# EAGLE schematic HID (EAGLE 8.0.1)
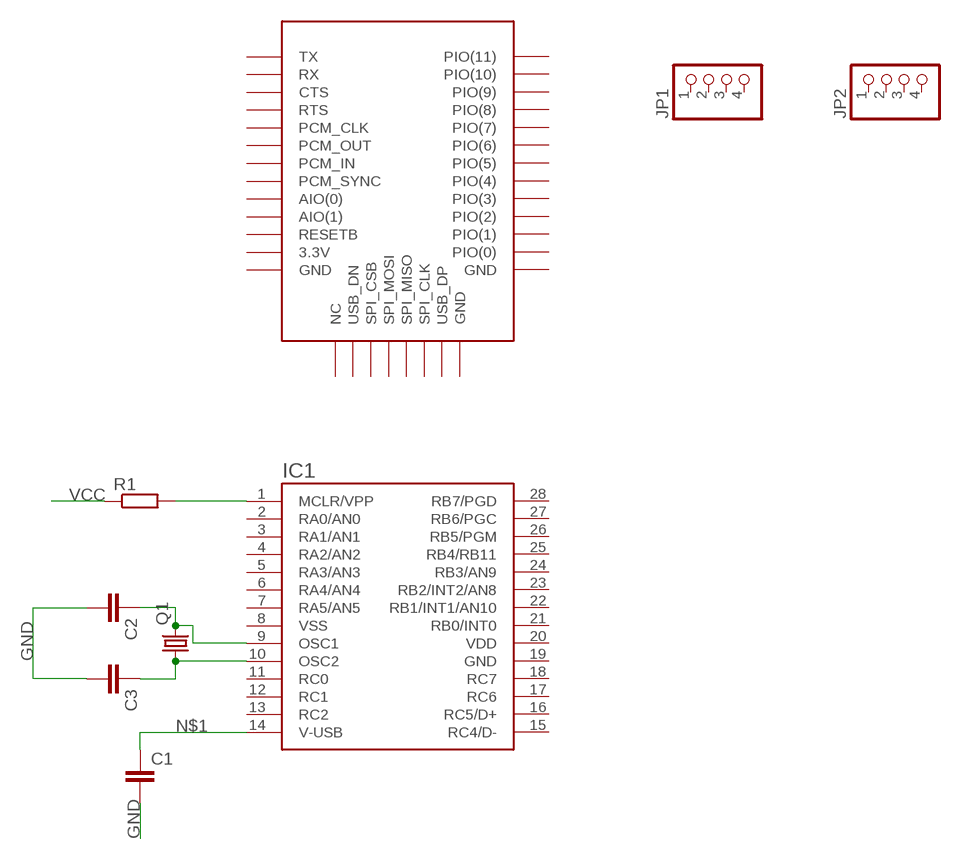
[diagram p0: schematic, sheet 1]

## Parts
C1  C2.5/5  [C2.5-5]
C2  C2.5/2  [C2.5-2]
C3  C2.5/2  [C2.5-2]
IC1  PIC18F2550SMD-28  [SO28]
IC2  BC04_BLUETOOTH  [BC04]
JP1  PINHD-1X4  [1X04]
JP2  PINHD-1X4  [1X04]
Q1  CRYSTALHC49U-V  [HC49U-V]
R1  R-EU_0207/10  [0207/10]

## Nets
GND: C1.2 C2.2 C3.2
N$1: C1.1 IC1.14(V-USB)
N$2: C3.1 IC1.10(OSC2) Q1.1
N$3: C2.1 IC1.9(OSC1) Q1.2
N$4: IC1.1(MCLR/VPP) R1.2
VCC: R1.1
Unconnected: IC1.2(RA0/AN0) IC1.3(RA1/AN1) IC1.4(RA2/AN2) IC1.5(RA3/AN3) IC1.6(RA4/AN4) IC1.7(RA5/AN5) IC1.8(VSS) IC1.11(RC0) IC1.12(RC1) IC1.13(RC2) IC1.15(RC4/D-) IC1.16(RC5/D+) IC1.17(RC6) IC1.18(RC7) IC1.19(GND) IC1.20(VDD) IC1.21(RB0/INT0) IC1.22(RB1/INT1/AN10) IC1.23(RB2/INT2/AN8) IC1.24(RB3/AN9) IC1.25(RB4/RB11) IC1.26(RB5/PGM) IC1.27(RB6/PGC) IC1.28(RB7/PGD) IC2.P$1(TX) IC2.P$2(RX) IC2.P$3(CTS) IC2.P$4(RTS) IC2.P$5(PCM_CLK) IC2.P$6(PCM_OUT) IC2.P$7(PCM_IN) IC2.P$8(PCM_SYNC) IC2.P$9(AIO(0)) IC2.P$10(AIO(1)) IC2.P$11(RESETB) IC2.P$12(3.3V) IC2.P$13(GND) IC2.P$14(NC) IC2.P$15(USB_DN) IC2.P$16(SPI_CSB) IC2.P$17(SPI_MOSI) IC2.P$18(SPI_MISO) IC2.P$19(SPI_CLK) IC2.P$20(USB_DP) IC2.P$21(GND) IC2.P$22(GND) IC2.P$23(PIO(0)) IC2.P$24(PIO(1)) IC2.P$25(PIO(2)) IC2.P$26(PIO(3)) IC2.P$27(PIO(4)) IC2.P$28(PIO(5)) IC2.P$29(PIO(6)) IC2.P$30(PIO(7)) IC2.P$31(PIO(8)) IC2.P$32(PIO(9)) IC2.P$33(PIO(10)) IC2.P$34(PIO(11)) JP1.1 JP1.2 JP1.3 JP1.4 JP2.1 JP2.2 JP2.3 JP2.4

## Library data of the parts
C1-C3 = capacitor-wima:C: CAPACITOR naming: grid - package width
IC1 = pic18f2550:PIC18F2550: PIC18F2550 Richard Myrick T. Arellaga April 2010
IC2 = bc04:BC04_BLUETOOTH; IC: BC04
JP1 JP2 = pinhead:PINHD-1X4: PIN HEADER
Q1 = crystal:CRYSTAL: CRYSTAL; OC_FARNELL: 1666969; OC_NEWARK: unknown
R1 = resistor:R-EU_: RESISTOR, European symbol